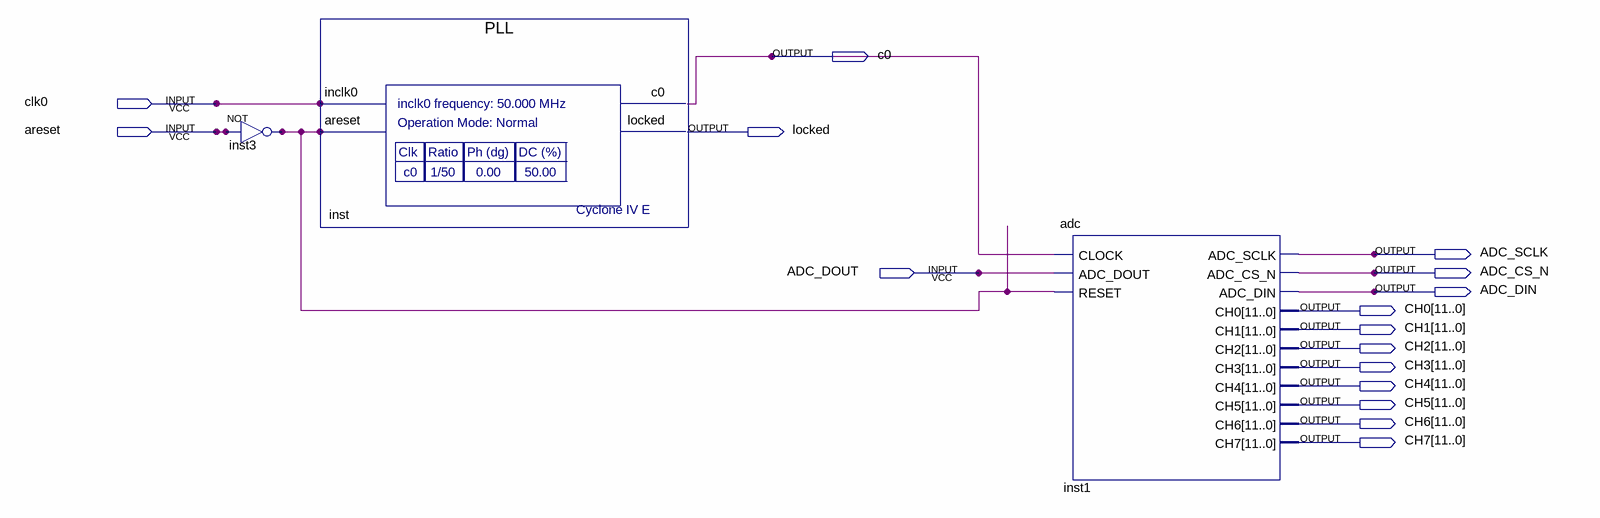
[diagram p0: schematic sheet]
// Quartus schematic ADC_tutorial.bdf as structural Verilog: 3 symbols, 16 pins
module ADC_tutorial (
  input  clk0,
  input  areset,
  input  ADC_DOUT,
  output c0,
  output locked,
  output ADC_SCLK,
  output ADC_CS_N,
  output ADC_DIN,
  output [11:0] CH0,
  output [11:0] CH1,
  output [11:0] CH2,
  output [11:0] CH3,
  output [11:0] CH4,
  output [11:0] CH5,
  output [11:0] CH6,
  output [11:0] CH7
);

  wire inst3_out;

  not inst3 (inst3_out, areset);
  PLL inst (.inclk0(clk0), .areset(inst3_out), .c0(c0), .locked(locked));
  adc inst1 (
    .CLOCK(c0), .ADC_DOUT(ADC_DOUT), .RESET(inst3_out), .ADC_SCLK(ADC_SCLK), .ADC_CS_N(ADC_CS_N),
    .ADC_DIN(ADC_DIN), .CH0(CH0), .CH1(CH1), .CH2(CH2), .CH3(CH3), .CH4(CH4), .CH5(CH5), .CH6(CH6), .CH7(CH7));
endmodule
